# Altium schematic sheet analog_interfaces.SchDoc
size A4; SheetNumber: 6; SheetTotal: 6
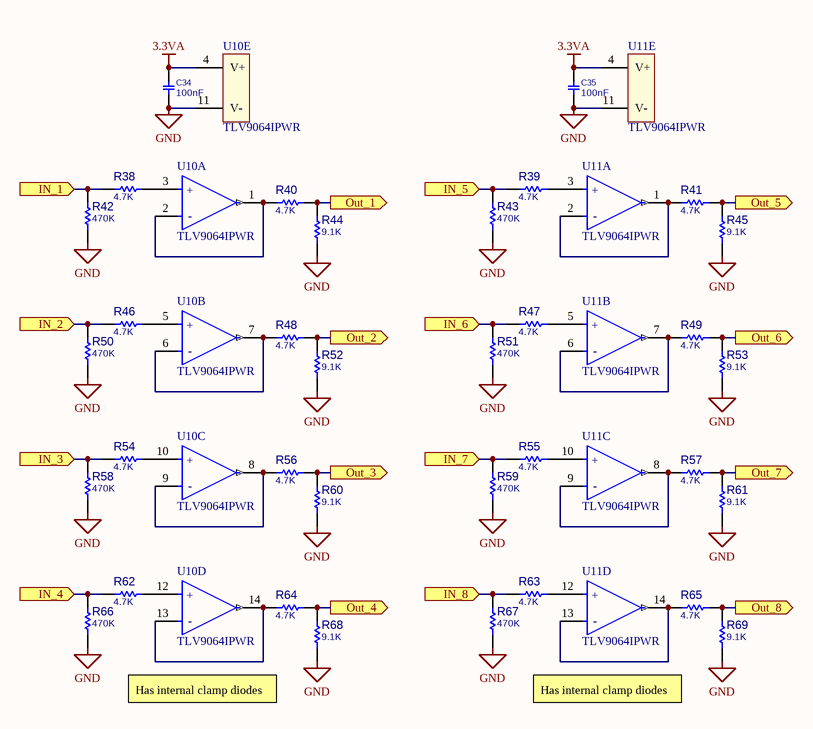
[diagram p0: analog_interfaces.SchDoc]

## Parts
C34  100nF  [C0805]
C35  100nF  [C0805]
R38  4.7K  [R0805]
R39  4.7K  [R0805]
R40  4.7K  [R0805]
R41  4.7K  [R0805]
R42  470K  [R0805]
R43  470K  [R0805]
R44  9.1K  [R0805]
R45  9.1K  [R0805]
R46  4.7K  [R0805]
R47  4.7K  [R0805]
R48  4.7K  [R0805]
R49  4.7K  [R0805]
R50  470K  [R0805]
R51  470K  [R0805]
R52  9.1K  [R0805]
R53  9.1K  [R0805]
R54  4.7K  [R0805]
R55  4.7K  [R0805]
R56  4.7K  [R0805]
R57  4.7K  [R0805]
R58  470K  [R0805]
R59  470K  [R0805]
R60  9.1K  [R0805]
R61  9.1K  [R0805]
R62  4.7K  [R0805]
R63  4.7K  [R0805]
R64  4.7K  [R0805]
R65  4.7K  [R0805]
R66  470K  [R0805]
R67  470K  [R0805]
R68  9.1K  [R0805]
R69  9.1K  [R0805]
U10  TLV9064IPWR  [TTSOP-14]  (parts A,B,C,D,E of 5)
U11  TLV9064IPWR  [TTSOP-14]  (parts A,B,C,D,E of 5)

## Ports
IN_1 (in), IN_2 (in), IN_3 (in), IN_4 (in), IN_5 (in), IN_6 (in), IN_7 (in), IN_8 (in), Out_1 (out), Out_2 (out), Out_3 (out), Out_4 (out), Out_5 (out), Out_6 (out), Out_7 (out), Out_8 (out)

## Nets
3.3VA: C34.2 C35.2 U10.4(V+) U11.4(V+)
GND: C34.1 C35.1 R42.2 R43.2 R44.2 R45.2 R50.2 R51.2 R52.2 R53.2 R58.2 R59.2 R60.2 R61.2 R66.2 R67.2 R68.2 R69.2 U10.11(V-) U11.11(V-)
IN_1: R38.2 R42.1 ; port IN_1
IN_2: R46.2 R50.1 ; port IN_2
IN_3: R54.2 R58.1 ; port IN_3
IN_4: R62.2 R66.1 ; port IN_4
IN_5: R39.2 R43.1 ; port IN_5
IN_6: R47.2 R51.1 ; port IN_6
IN_7: R55.2 R59.1 ; port IN_7
IN_8: R63.2 R67.1 ; port IN_8
Out_1: R40.1 R44.1 ; port Out_1
Out_2: R48.1 R52.1 ; port Out_2
Out_3: R56.1 R60.1 ; port Out_3
Out_4: R64.1 R68.1 ; port Out_4
Out_5: R41.1 R45.1 ; port Out_5
Out_6: R49.1 R53.1 ; port Out_6
Out_7: R57.1 R61.1 ; port Out_7
Out_8: R65.1 R69.1 ; port Out_8
NetR38_1: R38.1 U10.3(IN1+)
NetR39_1: R39.1 U11.3(IN1+)
NetR40_2: R40.2 U10.1(OUT1) U10.2(IN1-)
NetR41_2: R41.2 U11.1(OUT1) U11.2(IN1-)
NetR46_1: R46.1 U10.5(IN2+)
NetR47_1: R47.1 U11.5(IN2+)
NetR48_2: R48.2 U10.6(IN2-) U10.7(OUT2)
NetR49_2: R49.2 U11.6(IN2-) U11.7(OUT2)
NetR54_1: R54.1 U10.10(IN3+)
NetR55_1: R55.1 U11.10(IN3+)
NetR56_2: R56.2 U10.8(OUT3) U10.9(IN3-)
NetR57_2: R57.2 U11.8(OUT3) U11.9(IN3-)
NetR62_1: R62.1 U10.12(IN4+)
NetR63_1: R63.1 U11.12(IN4+)
NetR64_2: R64.2 U10.13(IN4-) U10.14(OUT4)
NetR65_2: R65.2 U11.13(IN4-) U11.14(OUT4)

## Notes on the sheet
- Has internal clamp diodes
- (in symbol TLV9064, part A) +; -
- (in symbol TLV9064, part B) +; -
- (in symbol TLV9064, part C) +; -
- (in symbol TLV9064, part D) +; -

## Library data of the parts
C34 C35 = CAP_SMD_MLCC: CAP, MLCC; PARAM: C0G, 10%; DESC: CAP, MLCC, 1nF, 50V, C0G, 10%, 0402; MANF_P#: MANF_PART#; MANF: Murata; PARAM2: 50V; PRICE: 100= 1$; ASSEMBLY: ASSEMBLY; VALUE: 100nF
R38-R69 = RES_SMD: RESISTOR, SMD; PARAM: -W; DESC: DESCRIPTION; DIST#: MOUSER; PARAM2: 1%; MANF_P#: -; MANF: -; ASSEMBLY: ASSEMBLY; PRICE: 100= 0.5$
  R38-R41 R46-R49 R54-R57 R62-R65: VALUE: 4.7K
  R42 R43 R50 R51 R58 R59 R66 R67: VALUE: 470K
  R44 R45 R52 R53 R60 R61 R68 R69: VALUE: 9.1K
U10 U11 = TLV9064: IC CMOS 4 CIRCUIT 14TSSOP; Output Current per Channel: 50mA; Gain Bandwidth Product: 10MHz; Operating Supply Current: 538uA; Input Bias Current: 0.5pA; Input Offset Voltage (Vos): 300uV; Number of Channels: 4; Slew Rate: 6.5V/µs; Mount: Surface Mount; Min Operating Temperature: -40°C; Case/Package: TSSOP; RoHS Compliant: Yes; Packaging: Tape and Reel; Number of Pins: 14; Number of Circuits: 4; Max Operating Temperature: 125°C